# EAGLE design MOL-v1.7 (EAGLE 8.2.2)
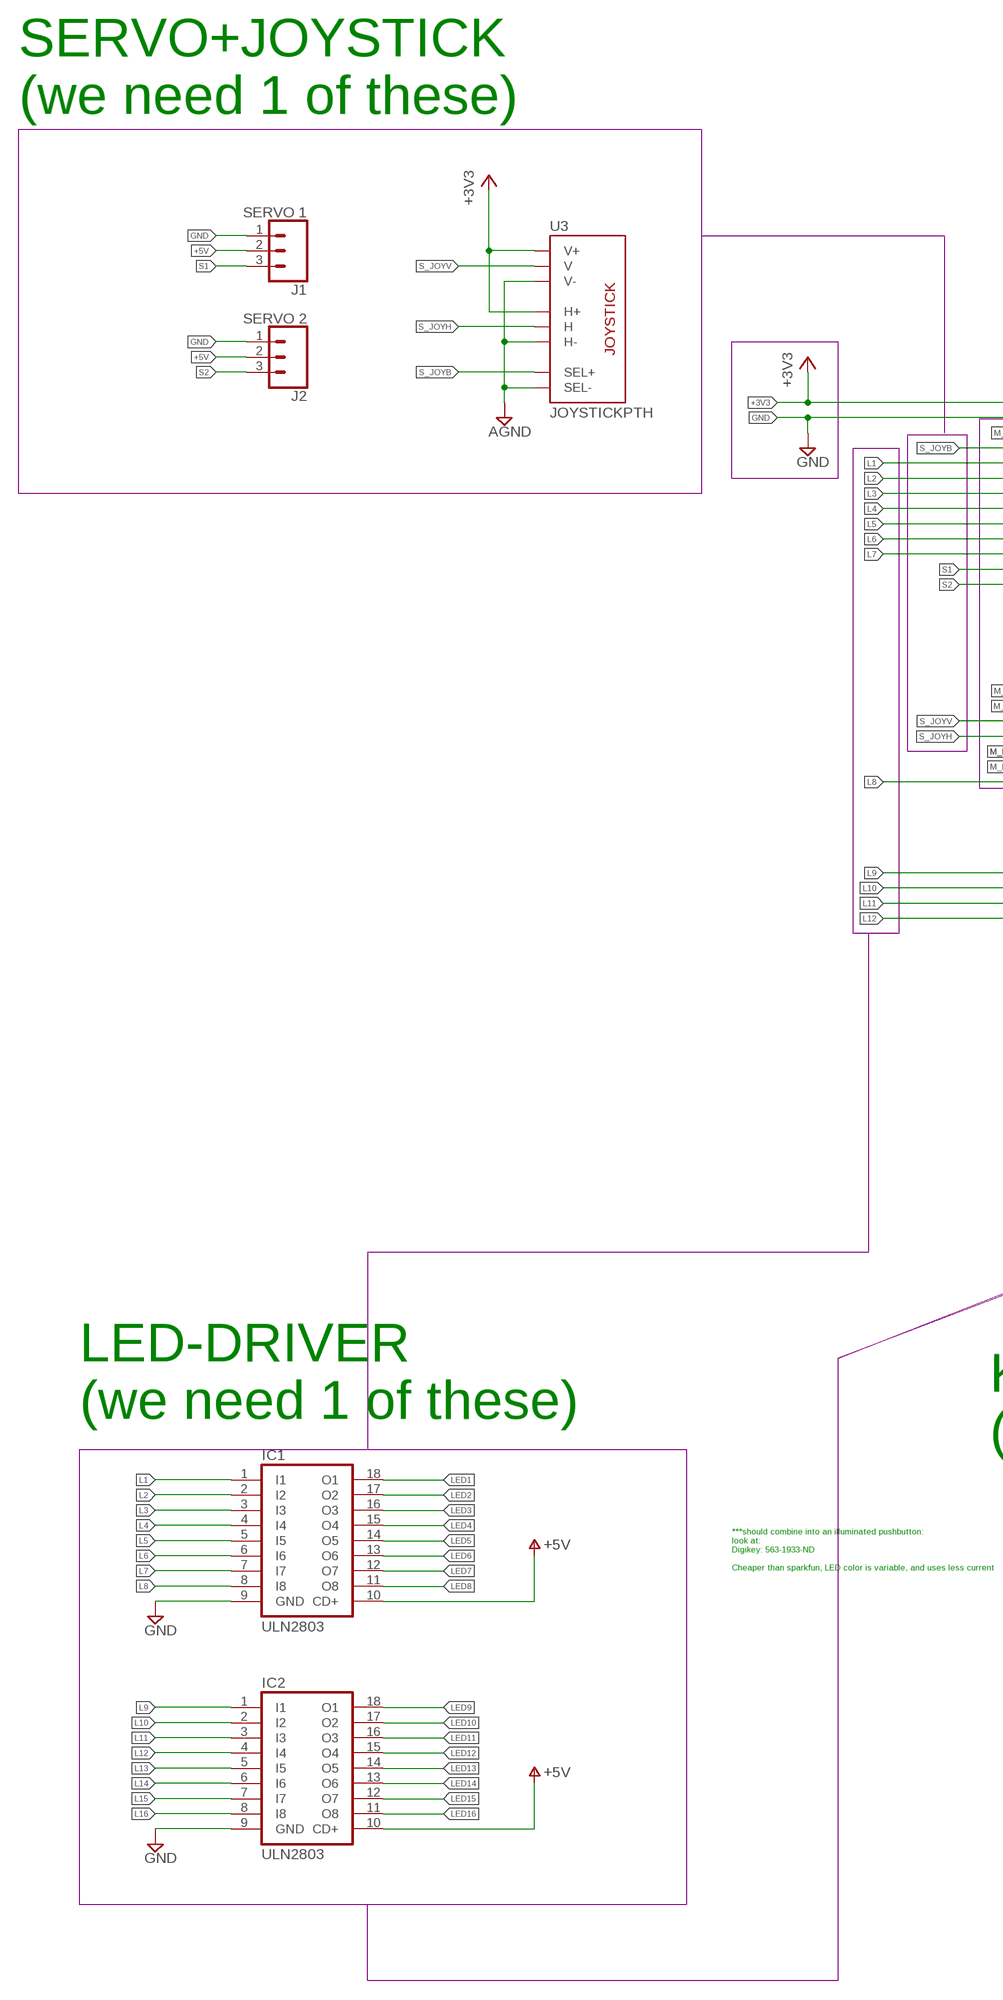
[diagram p0: schematic, sheet 1, part 1 of 2]
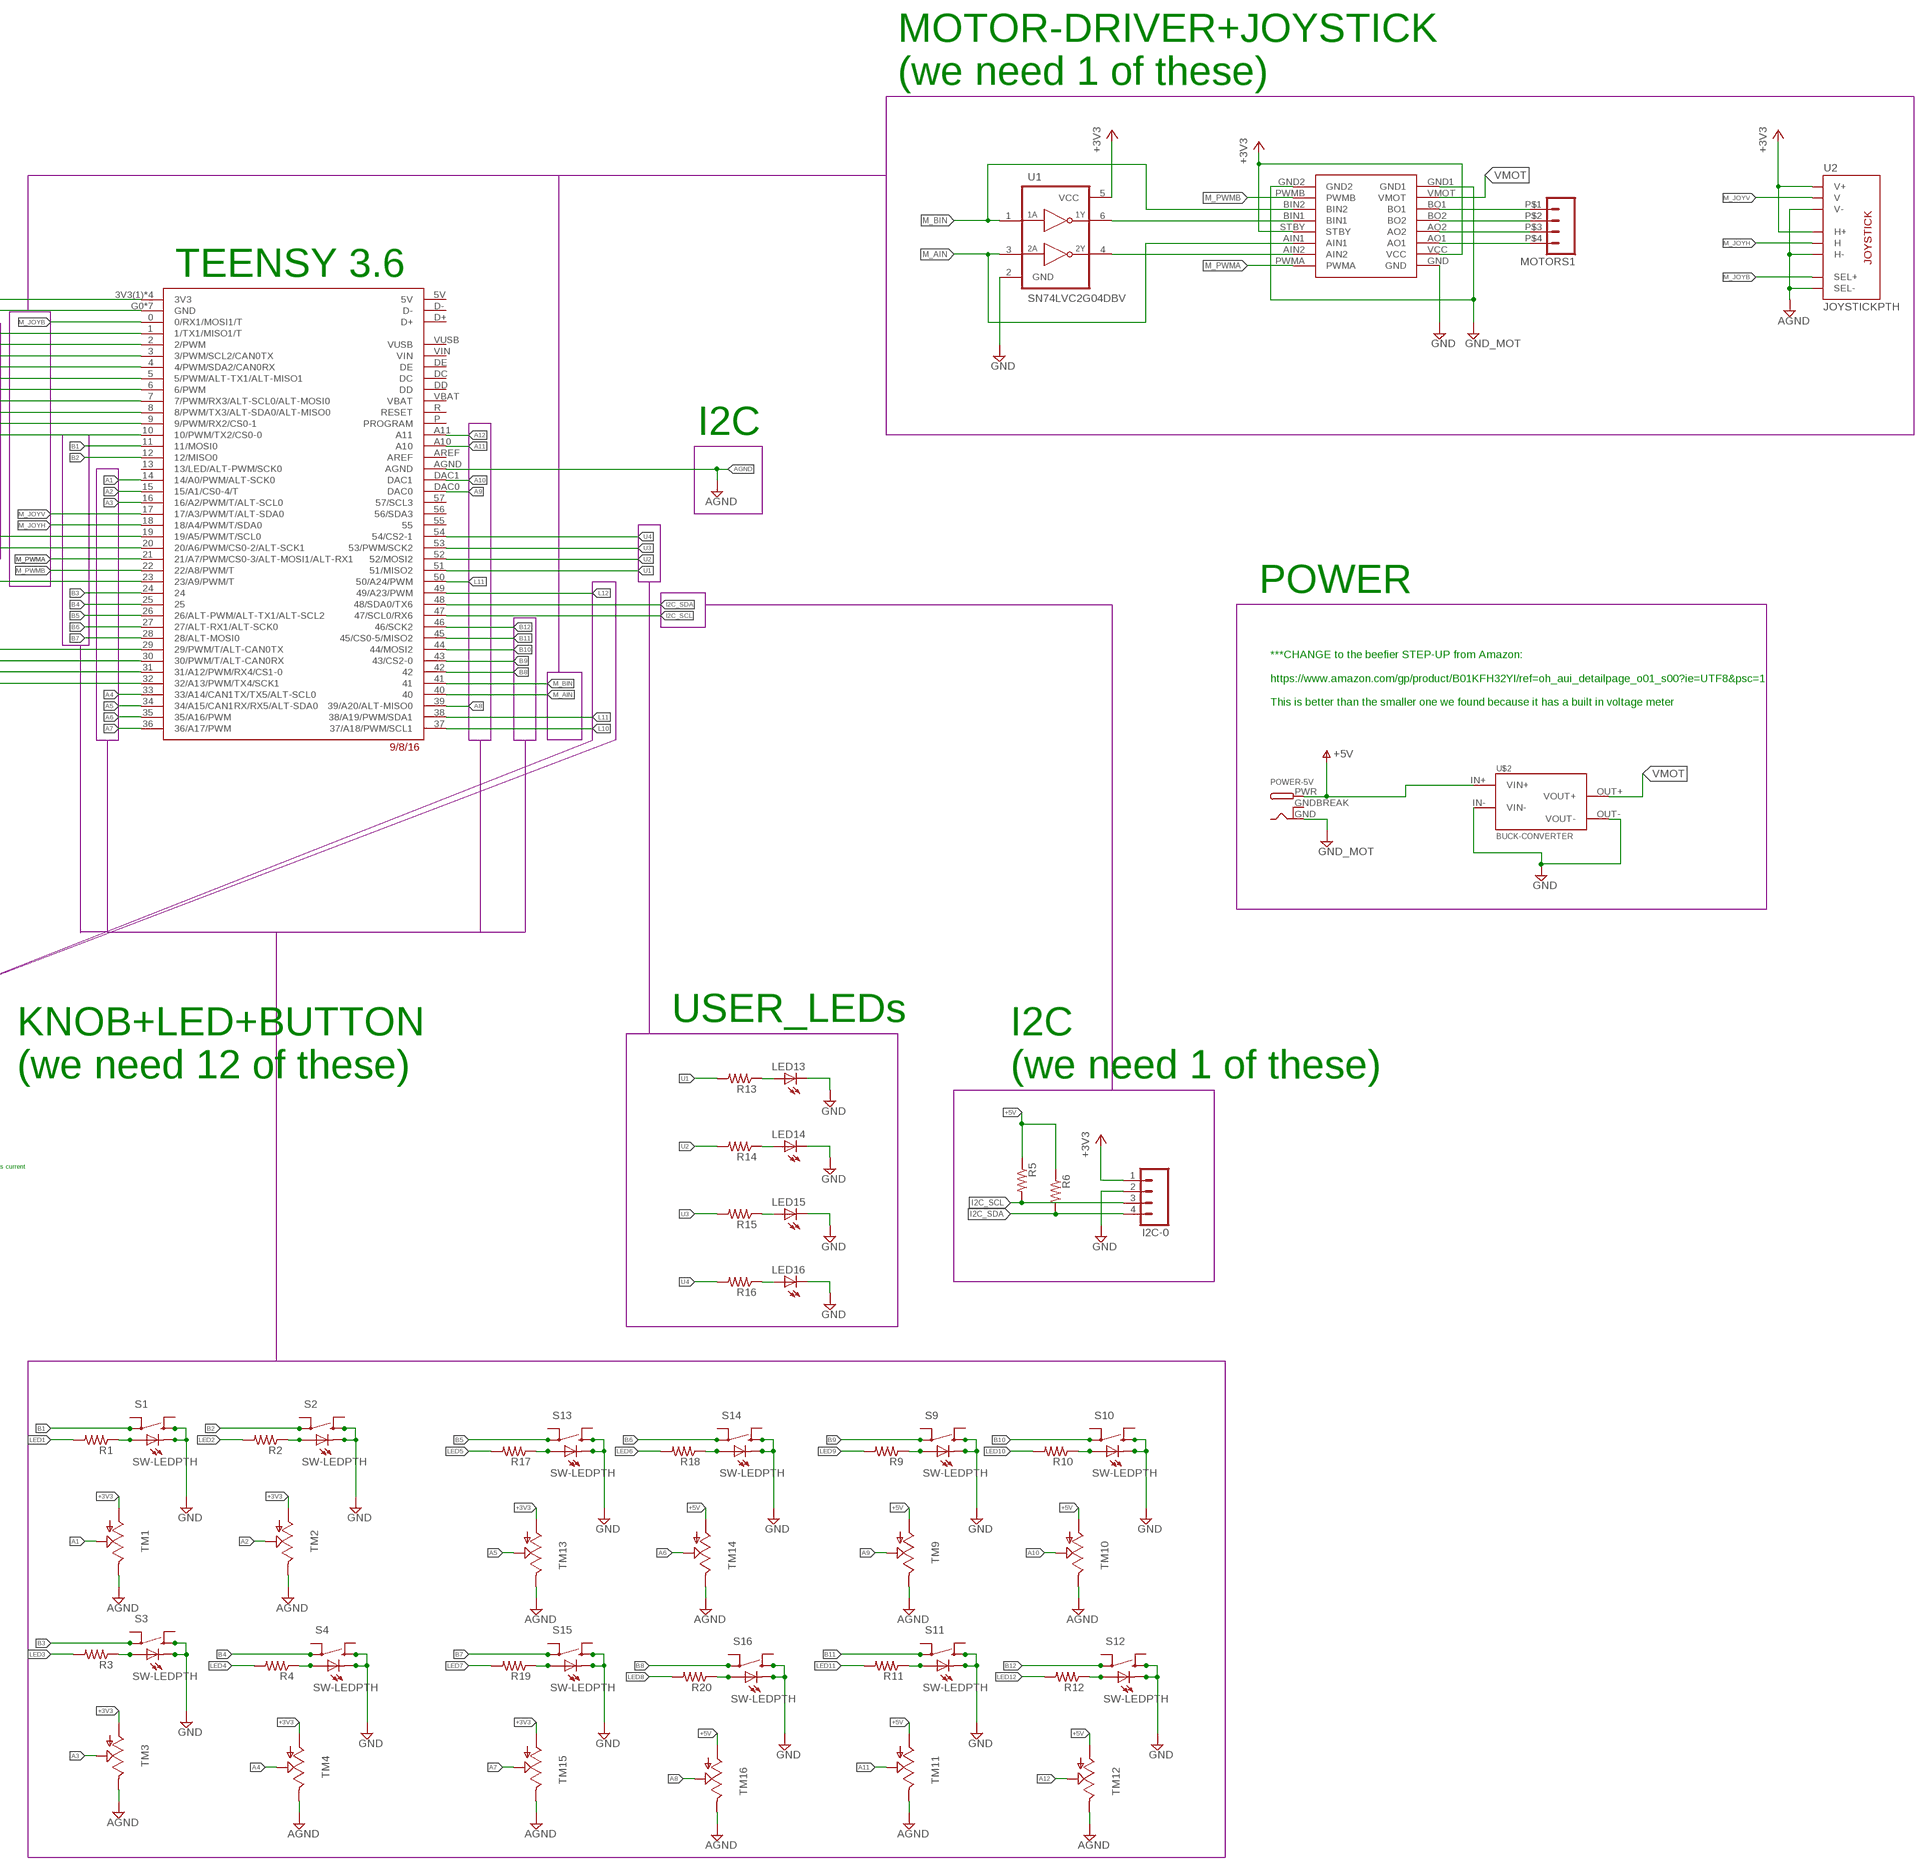
[diagram p1: schematic, sheet 1, part 2 of 2]

## Parts
I2C-0  M04LOCK  [1X04_LOCK]
IC1  ULN2803  ULN2803A  [DIL18]
IC2  ULN2803  ULN2803A  [DIL18]
J1  SERVO 1  CONN_03LOCK  [1X03_LOCK]
J2  SERVO 2  CONN_03LOCK  [1X03_LOCK]
LED13  LED3MM  [LED3MM]
LED14  LED3MM  [LED3MM]
LED15  LED3MM  [LED3MM]
LED16  LED3MM  [LED3MM]
MOTORS1  M04  [SPRINGTERMINAL-2.54MM-4]
POWER-5V  DCBARRELPTH  [DCJACK_2MM_PTH]
R1  R-US_R0603  [R0603]
R2  R-US_R0603  [R0603]
R3  R-US_R0603  [R0603]
R4  R-US_R0603  [R0603]
R5  R-US_R0603  [R0603]
R6  R-US_R0603  [R0603]
R9  R-US_R0603  [R0603]
R10  R-US_R0603  [R0603]
R11  R-US_R0603  [R0603]
R12  R-US_R0603  [R0603]
R13  R-US_R0603  [R0603]
R14  R-US_R0603  [R0603]
R15  R-US_R0603  [R0603]
R16  R-US_R0603  [R0603]
R17  R-US_R0603  [R0603]
R18  R-US_R0603  [R0603]
R19  R-US_R0603  [R0603]
R20  R-US_R0603  [R0603]
S1  SW-LEDPTH  [TR2-SWITCH-MOMENTARY-LED]
S2  SW-LEDPTH  [TR2-SWITCH-MOMENTARY-LED]
S3  SW-LEDPTH  [TR2-SWITCH-MOMENTARY-LED]
S4  SW-LEDPTH  [TR2-SWITCH-MOMENTARY-LED]
S9  SW-LEDPTH  [TR2-SWITCH-MOMENTARY-LED]
S10  SW-LEDPTH  [TR2-SWITCH-MOMENTARY-LED]
S11  SW-LEDPTH  [TR2-SWITCH-MOMENTARY-LED]
S12  SW-LEDPTH  [TR2-SWITCH-MOMENTARY-LED]
S13  SW-LEDPTH  [TR2-SWITCH-MOMENTARY-LED]
S14  SW-LEDPTH  [TR2-SWITCH-MOMENTARY-LED]
S15  SW-LEDPTH  [TR2-SWITCH-MOMENTARY-LED]
S16  SW-LEDPTH  [TR2-SWITCH-MOMENTARY-LED]
TM1  TRIM  [TRIM-PCB-9MM]
TM2  TRIM  [TRIM-PCB-9MM]
TM3  TRIM  [TRIM-PCB-9MM]
TM4  TRIM  [TRIM-PCB-9MM]
TM9  TRIM  [TRIM-PCB-9MM]
TM10  TRIM  [TRIM-PCB-9MM]
TM11  TRIM  [TRIM-PCB-9MM]
TM12  TRIM  [TRIM-PCB-9MM]
TM13  TRIM  [TRIM-PCB-9MM]
TM14  TRIM  [TRIM-PCB-9MM]
TM15  TRIM  [TRIM-PCB-9MM]
TM16  TRIM  [TRIM-PCB-9MM]
U1  SN74LVC2G04DBV  [SOT23-6]
U2  JOYSTICKPTH  [JOYSTICK]
U3  JOYSTICKPTH  [JOYSTICK]
U$1  TEENSY3_6--ALLPINS  [T36]
U$2  BUCK-CONVERTER  [BUCK-CONVERTER]
U$7  POLOLU_TB6612FNG  [POLOLU_TB6612FNG]

## Nets
+3V3: I2C-0.1 TM1.1(A) TM2.1(A) TM3.1(A) TM4.1(A) TM13.1(A) TM15.1(A) U1.5(VCC) U2.H1(H+) U2.V1(V+) U3.H1(H+) U3.V1(V+) U$1.3V3(1)(3V3) U$1.3V3(2)(3V3) U$1.3V3(3)(3V3) U$1.3V3(4)(3V3) U$7.STBY U$7.VCC
+5V [Power]: IC1.10(CD+) IC2.10(CD+) J1.2 J2.2 POWER-5V.PWR R5.1 R6.1 TM9.1(A) TM10.1(A) TM11.1(A) TM12.1(A) TM14.1(A) TM16.1(A) U$2.IN+(VIN+) ; supply symbol labelled V+
A1: TM1.2(S) U$1.14(14/A0/PWM/ALT-SCK0)
A2: TM2.2(S) U$1.15(15/A1/CS0-4/T)
A3: TM3.2(S) U$1.16(16/A2/PWM/T/ALT-SCL0)
A4: TM4.2(S) U$1.33(33/A14/CAN1TX/TX5/ALT-SCL0)
A5: TM13.2(S) U$1.34(34/A15/CAN1RX/RX5/ALT-SDA0)
A6: TM14.2(S) U$1.35(35/A16/PWM)
A7: TM15.2(S) U$1.36(36/A17/PWM)
A8: TM16.2(S) U$1.39(39/A20/ALT-MISO0)
A9: TM9.2(S) U$1.DAC0
A10: TM10.2(S) U$1.DAC1
A11: TM11.2(S) U$1.A10
A12: TM12.2(S) U$1.A11
AGND: TM1.3(E) TM2.3(E) TM3.3(E) TM4.3(E) TM9.3(E) TM10.3(E) TM11.3(E) TM12.3(E) TM13.3(E) TM14.3(E) TM15.3(E) TM16.3(E) U2.B2A(SEL-) U2.H3(H-) U2.V3(V-) U3.B2A(SEL-) U3.H3(H-) U3.V3(V-) U$1.AGND
B1: S1.3 U$1.11(11/MOSI0)
B2: S2.3 U$1.12(12/MISO0)
B3: S3.3 U$1.24
B4: S4.3 U$1.25
B5: S13.3 U$1.26(26/ALT-PWM/ALT-TX1/ALT-SCL2)
B6: S14.3 U$1.27(27/ALT-RX1/ALT-SCK0)
B7: S15.3 U$1.28(28/ALT-MOSI0)
B8: S16.3 U$1.42
B9: S9.3 U$1.43(43/CS2-0)
B10: S10.3 U$1.44(44/MOSI2)
B11: S11.3 U$1.45(45/CS0-5/MISO2)
B12: S12.3 U$1.46(46/SCK2)
GND: I2C-0.2 IC1.9(GND) IC2.9(GND) J1.1 J2.1 LED13.K(C) LED14.K(C) LED15.K(C) LED16.K(C) S1.1 S1.C S2.1 S2.C S3.1 S3.C S4.1 S4.C S9.1 S9.C S10.1 S10.C S11.1 S11.C S12.1 S12.C S13.1 S13.C S14.1 S14.C S15.1 S15.C S16.1 S16.C U1.2(GND) U$1.G0(GND) U$1.G1(GND) U$1.G2(GND) U$1.G3(GND) U$1.G4(GND) U$1.G5(GND) U$1.G6(GND) U$2.IN-(VIN-) U$2.OUT-(VOUT-) U$7.GND
GND_MOT [Power]: POWER-5V.GND U$7.GND1 U$7.GND2
I2C_SCL: I2C-0.3 R5.2 U$1.47(47/SCL0/RX6)
I2C_SDA: I2C-0.4 R6.2 U$1.48(48/SDA0/TX6)
L1: IC1.1(I1) U$1.2(2/PWM)
L2: IC1.2(I2) U$1.3(3/PWM/SCL2/CAN0TX)
L3: IC1.3(I3) U$1.4(4/PWM/SDA2/CAN0RX)
L4: IC1.4(I4) U$1.5(5/PWM/ALT-TX1/ALT-MISO1)
L5: IC1.5(I5) U$1.6(6/PWM)
L6: IC1.6(I6) U$1.7(7/PWM/RX3/ALT-SCL0/ALT-MOSI0)
L7: IC1.7(I7) U$1.8(8/PWM/TX3/ALT-SDA0/ALT-MISO0)
L8: IC1.8(I8) U$1.23(23/A9/PWM/T)
L9: IC2.1(I1) U$1.29(29/PWM/T/ALT-CAN0TX)
L10: IC2.2(I2) U$1.30(30/PWM/T/ALT-CAN0RX) U$1.37(37/A18/PWM/SCL1)
L11: IC2.3(I3) U$1.31(31/A12/PWM/RX4/CS1-0) U$1.38(38/A19/PWM/SDA1) U$1.50(50/A24/PWM)
L12: IC2.4(I4) U$1.32(32/A13/PWM/TX4/SCK1) U$1.49(49/A23/PWM)
L13: IC2.5(I5)
L14: IC2.6(I6)
L15: IC2.7(I7)
L16: IC2.8(I8)
LED1: IC1.18(O1) R1.2
LED2: IC1.17(O2) R2.2
LED3: IC1.16(O3) R3.2
LED4: IC1.15(O4) R4.2
LED5: IC1.14(O5) R17.2
LED6: IC1.13(O6) R18.2
LED7: IC1.12(O7) R19.2
LED8: IC1.11(O8) R20.2
LED9: IC2.18(O1) R9.2
LED10: IC2.17(O2) R10.2
LED11: IC2.16(O3) R11.2
LED12: IC2.15(O4) R12.2
LED13: IC2.14(O5)
LED14: IC2.13(O6)
LED15: IC2.12(O7)
LED16: IC2.11(O8)
M_AIN: U1.3(2A) U$1.40 U$7.AIN1
M_BIN: U1.1(1A) U$1.41 U$7.BIN2
M_JOYB: U2.B1A(SEL+) U$1.0(0/RX1/MOSI1/T)
M_JOYH: U2.H2(H) U$1.18(18/A4/PWM/T/SDA0)
M_JOYV: U2.V2(V) U$1.17(17/A3/PWM/T/ALT-SDA0)
M_PWMA: U$1.21(21/A7/PWM/CS0-3/ALT-MOSI1/ALT-RX1) U$7.PWMA
M_PWMB: U$1.22(22/A8/PWM/T) U$7.PWMB
N$1: R1.1 S1.A
N$2: LED13.A R13.1
N$3: LED14.A R14.1
N$4: LED15.A R15.1
N$5: U1.6(1Y) U$7.BIN1
N$6: U1.4(2Y) U$7.AIN2
N$7: LED16.A R16.1
N$8: R2.1 S2.A
N$9: R3.1 S3.A
N$10: R4.1 S4.A
N$15: R9.1 S9.A
N$16: R10.1 S10.A
N$17: R11.1 S11.A
N$18: R12.1 S12.A
N$19: R17.1 S13.A
N$20: R18.1 S14.A
N$21: R19.1 S15.A
N$22: R20.1 S16.A
N$45 [Power]: MOTORS1.P$1 U$7.BO1
N$46 [Power]: MOTORS1.P$2 U$7.BO2
N$52 [Power]: MOTORS1.P$3 U$7.AO2
N$54 [Power]: MOTORS1.P$4 U$7.AO1
S1: J1.3 U$1.9(9/PWM/RX2/CS0-1)
S2: J2.3 U$1.10(10/PWM/TX2/CS0-0)
S_JOYB: U3.B1A(SEL+) U$1.1(1/TX1/MISO1/T)
S_JOYH: U3.H2(H) U$1.20(20/A6/PWM/CS0-2/ALT-SCK1)
S_JOYV: U3.V2(V) U$1.19(19/A5/PWM/T/SCL0)
U1: R13.2 U$1.51(51/MISO2)
U2: R14.2 U$1.52(52/MOSI2)
U3: R15.2 U$1.53(53/PWM/SCK2)
U4: R16.2 U$1.54(54/CS2-1)
VMOT [Power]: U$2.OUT+(VOUT+) U$7.VMOT
Unconnected: S1.2 S1.4 S2.2 S2.4 S3.2 S3.4 S4.2 S4.4 S9.2 S9.4 S10.2 S10.4 S11.2 S11.4 S12.2 S12.4 S13.2 S13.4 S14.2 S14.4 S15.2 S15.4 S16.2 S16.4 U$1.5V U$1.13(13/LED/ALT-PWM/SCK0) U$1.55 U$1.56(56/SDA3) U$1.57(57/SCL3) U$1.AREF U$1.D+ U$1.D- U$1.DC U$1.DD U$1.DE U$1.P(PROGRAM) U$1.R(RESET) U$1.VBAT U$1.VIN U$1.VUSB

## Notes on the sheet
- SERVO+JOYSTICK
  (we need 1 of these)
- MOTOR-DRIVER+JOYSTICK
  (we need 1 of these)
- TEENSY 3.6
- I2C
- POWER
- ***CHANGE to the beefier STEP-UP from Amazon:
  
  https://www.amazon.com/gp/product/B01KFH32YI/ref=oh_aui_detailpage_o01_s00?ie=UTF8&psc=1
  
  This is better than the smaller one we found because it has a built in voltage meter
- USER_LEDs
- LED-DRIVER
  (we need 1 of these)
- KNOB+LED+BUTTON
  (we need 12 of these)
- I2C
  (we need 1 of these)
- ***should combine into an illuminated pushbutton:
  look at:
  Digikey: 563-1933-ND
  
  Cheaper than sparkfun, LED color is variable, and uses less current

## Power pins joined to a net without a drawn wire
GNDBREAK: POWER-5V.GNDBREAK

## Library data of the parts
I2C-0 MOTORS1 = CMU-ArtFab:M04: Header 4 Standard 4-pin 0.1" header. Use with straight break away headers (SKU : PRT-00116), right angle break away headers (PRT-00553), swiss pins (PRT-00743), machine pins (PRT-00117), and female headers (PRT-00115). Molex polarized connector foot print use with SKU : PRT-08231 with associated crimp pins and housings. 1MM SMD Version SKU: PRT-10208
IC1 IC2 = uln-udn:ULN2803A: DRIVER ARRAY
J1 J2 = SparkFun-Connectors:CONN_03: Multi connection point. Often used as Generic Header-pin footprint for 0.1 inch spaced/style header connections On any of the 0.1 inch spaced packages, you can populate with these: Break Away Headers - Straight <https://www.sparkfun.com/products/116> (PRT-00116) Break Away Male Headers - Right Angle <https://www.sparkfun.com/products/553> (PRT-00553) Female Headers <https://www.sparkfun.com/products/115> (PRT-00115) Break Away Headers - Machine Pin <https://www.sparkfun.com/products/117> (PRT-00117) Break Away Female Headers - Swiss Machine Pin <https://www.sparkfun.com/products/743> (PRT-00743) Stackable Header - 3 Pin (Female, 0.1") <https://www.sparkfun.com/products/13875> (PRT-13875) For SCREWTERMINALS and SPRING TERMINALS visit here: Screw Terimnals on SparkFun.com <https://www.sparkfun.com/search/results?term=Screw+Terminals> (5mm/3.5mm/2.54mm spacing) This device is also useful as a general connection point to wire up your design to another part of your project. Our various solder wires solder well into these plated through hole pads. Hook-Up Wire - Assortment (Stranded, 22 AWG) <https://www.sparkfun.com/products/11375> (PRT-11375) Hook-Up Wire - Assortment (Solid Core, 22 AWG) <https://www.sparkfun.com/products/11367> (PRT-11367) View the entire wire category on our website here <https://www.sparkfun.com/categories/141> Special notes: Molex polarized connector foot print use with SKU : PRT-08232 with associated crimp pins and housings.
LED13-LED16 = led:LED: LED OSRAM: - CHIPLED LG R971, LG N971, LY N971, LG Q971, LY Q971, LO R971, LY R971 LH N974, LH R974 LS Q976, LO Q976, LY Q976 LO Q996 - Hyper CHIPLED LW Q18S LB Q993, LB Q99A, LB R99A - SideLED LS A670, LO A670, LY A670, LG A670, LP A670 LB A673, LV A673, LT A673, LW A673 LH A674 LY A675 LS A676, LA A676, LO A676, LY A676, LW A676 LS A679, LY A679, LG A679 - Hyper Micro SIDELED® LS Y876, LA Y876, LO Y876, LY Y876 LT Y87S - SmartLED LW L88C, LW L88S LB L89C, LB L89S, LG L890 LS L89K, LO L89K, LY L89K LS L896, LA L896, LO L896, LY L896 - TOPLED LS T670, LO T670, LY T670, LG T670, LP T670 LSG T670, LSP T670, LSY T670, LOP T670, LYG T670 LG T671, LOG T671, LSG T671 LB T673, LV T673, LT T673, LW T673 LH T674 LS T676, LA T676, LO T676, LY T676, LB T676, LH T676, LSB T676, LW T676 LB T67C, LV T67C, LT T67C, LS T67K, LO T67K, LY T67K, LW E67C LS E67B, LA E67B, LO E67B, LY E67B, LB E67C, LV E67C, LT E67C LW T67C LS T679, LY T679, LG T679 LS T770, LO T770, LY T770, LG T770, LP T770 LB T773, LV T773, LT T773, LW T773 LH T774 LS E675, LA E675, LY E675, LS T675 LS T776, LA T776, LO T776, LY T776, LB T776 LHGB T686 LT T68C, LB T68C - Hyper Mini TOPLED® LB M676 - Mini TOPLED Santana® LG M470 LS M47K, LO M47K, LY M47K Source: http://www.osram.convergy.de LUXEON: - LUMILED® LXK2-PW12-R00, LXK2-PW12-S00, LXK2-PW14-U00, LXK2-PW14-V00 LXK2-PM12-R00, LXK2-PM12-S00, LXK2-PM14-U00 LXK2-PE12-Q00, LXK2-PE12-R00, LXK2-PE12-S00, LXK2-PE14-T00, LXK2-PE14-U00 LXK2-PB12-K00, LXK2-PB12-L00, LXK2-PB12-M00, LXK2-PB14-N00, LXK2-PB14-P00, LXK2-PB14-Q00 LXK2-PR12-L00, LXK2-PR12-M00, LXK2-PR14-Q00, LXK2-PR14-R00 LXK2-PD12-Q00, LXK2-PD12-R00, LXK2-PD12-S00 LXK2-PH12-R00, LXK2-PH12-S00 LXK2-PL12-P00, LXK2-PL12-Q00, LXK2-PL12-R00 Source: www.luxeon.com KINGBRIGHT: KA-3528ASYC Source: www.kingbright.com
POWER-5V = adafruit:DCBARREL: 2.0mm DC Barrel Jack DCJACK_2MM_PTH - Through Hole Jack (4UConnector: 05537)
R1-R6 R9-R20 = CMU-ArtFab:R-US_: RESISTOR, American symbol
S1-S4 S9-S16 = Daniel:SW-LED: SWITCH PUSH SPST-NO 10MA 12V
TM1-TM4 TM9-TM16 = Daniel:TRIM
U1 = 74LV:SN74LVC2G04: DUAL INVERTER GATE
U2 U3 = adafruit:JOYSTICK: Thumb Joystick Joystick commonly found in PS2 controllers. Two pots and a select switch. Adapted from Sparkfun Library (but for more common 6mm switch sticks)
U$1 = Teensy_3_6:TEENSY3_6--ALLPINS
U$2 = Daniel:BUCK-CONVERTER
U$7 = CMU-ArtFab:POLOLU_TB6612FNG

## Net classes
2 Power: width 0.508 mm, clearance 0.152 mm

## Board
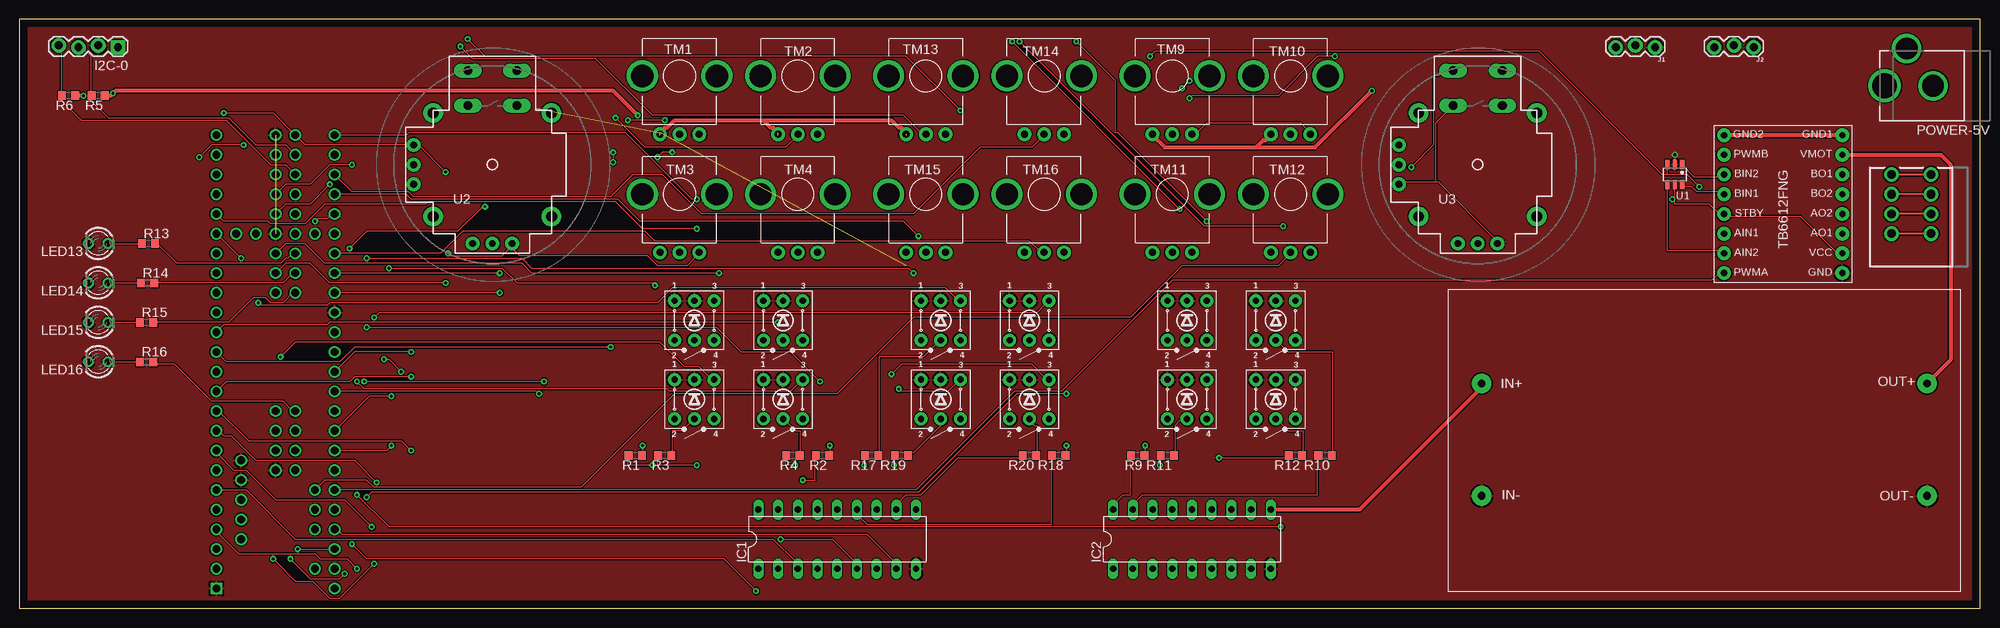
[diagram p2: board, top side]
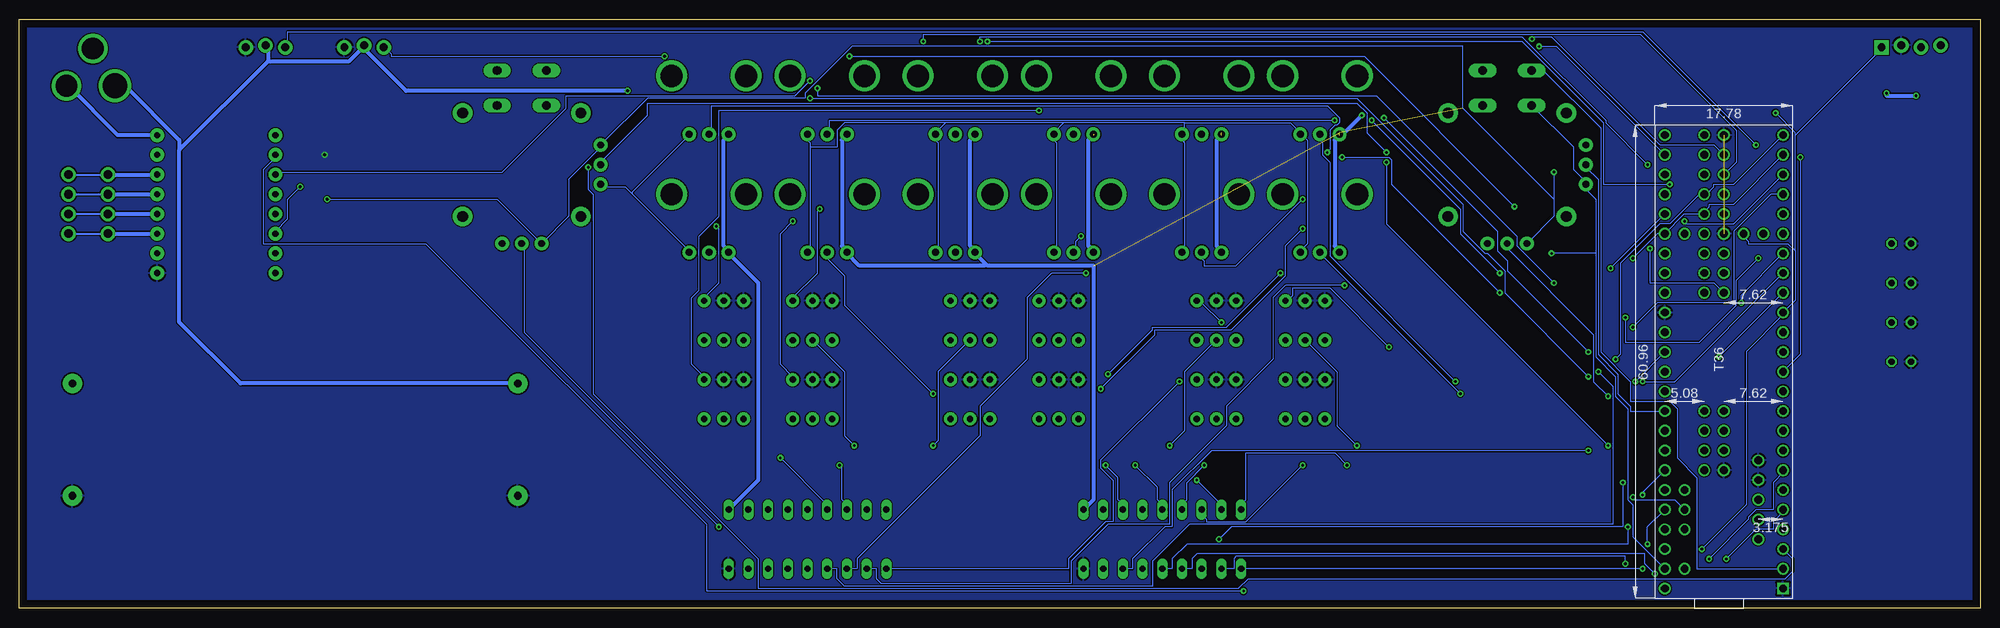
[diagram p3: board, bottom side, seen from below]

Size 252.71 x 75.87 mm. Coordinates in mm from the lower left corner, seen from the top.
Outline: 0,0 252.71,0 252.71,75.87 0,75.87 0,0
Copper layers (1*16): Top 0.035mm / dielectric 1.5mm / Bottom 0.035mm
Design rules "default": minimum track width 6mil, minimum drill 0.35mm, track to track 6mil, track to pad 6mil, pad to pad 6mil, via to via 6mil, smd to smd 6mil, copper to edge 40mil, drill to drill 6mil, minimum pad ring 10mil, minimum via ring 8mil, stop-mask expansion 4mil, vias tented up to drill 0mil, thermal gap 10mil

### Footprints (pad centres in the part's own frame; a part is rotated, then mirrored left to right if it is on the bottom)
1X04_LOCK = drill 1.016 pad 1.88 square: 1 0,0.127 | drill 1.016 pad 1.88: 2 2.54,-0.127; 3 5.08,0.127; 4 7.62,-0.127
DIL18 = drill 0.813 long: 1 -10.16,-3.81; 2 -7.62,-3.81; 3 -5.08,-3.81; 4 -2.54,-3.81; 5 0,-3.81; 6 2.54,-3.81; 7 5.08,-3.81; 8 7.62,-3.81; 9 10.16,-3.81; 10 10.16,3.81; 11 7.62,3.81; 12 5.08,3.81; 13 2.54,3.81; 14 0,3.81; 15 -2.54,3.81; 16 -5.08,3.81; 17 -7.62,3.81; 18 -10.16,3.81
1X03_LOCK = drill 1.016 pad 1.88: 1 0,0.127; 2 2.54,-0.127; 3 5.08,0.127
LED3MM = drill 0.813 octagon: A -1.27,0; K 1.27,0
SPRINGTERMINAL-2.54MM-4 = drill 1.1 pad 1.9: 1 7.62,-2.54; 2 5.08,-2.54; 3 2.54,-2.54; 4 0,-2.54; P$1 7.62,2.54; P$2 5.08,2.54; P$3 2.54,2.54; P$4 0,2.54
DCJACK_2MM_PTH = drill 2.8: GND 0,7.35; GNDBREAK 4.8,10.75 | drill 3.2: PWR 0,13.6
R0603 = smd 1 x 1.1: 1 -0.85,0; 2 0.85,0
TR2-SWITCH-MOMENTARY-LED = drill 0.8 pad 1.676: 1 2.54,-2.54; 2 2.54,2.54; 3 -2.54,-2.54; 4 -2.54,2.54; A 0,2.54; C 0,-2.54
TRIM-PCB-9MM = drill 0.9 pad 1.778: 1 -2.54,-7.5; 2 0,-7.5; 3 2.54,-7.5 | drill 2.845 pad 4: 5 -4.8,0; 6 -4.8,0; M1 -4.8,0; M2 4.8,0
SOT23-6 = smd 0.55 x 1.2: 1 -0.95,-1.3; 2 0,-1.3; 3 0.95,-1.3; 4 0.95,1.3; 5 0,1.3; 6 -0.95,1.3
JOYSTICK = drill 1.1 pad 1.778 long: B1A -3.175,12.12; B1B 3.175,12.12; B2A -3.175,7.62; B2B 3.175,7.62 | drill 0.889 pad 1.778: H1 -2.54,-10.16; H2 0,-10.16; H3 2.54,-10.16; V1 -10.16,2.54; V2 -10.16,0; V3 -10.16,-2.54 | drill 1.397 pad 2.54: MOUNT1 -7.62,6.668; MOUNT2 -7.62,-6.668; MOUNT3 7.62,-6.668; MOUNT4 7.62,6.668
T36 = drill 1: 0 -15.24,-5.08; 1 -12.7,-5.08; 2 -10.16,-5.08; 3 -7.62,-5.08; 3V3(1) 17.78,-5.08; 3V3(2) 27.94,0; 3V3(3) -12.7,10.16; 3V3(4) 40.64,5.08; 4 -5.08,-5.08; 5 -2.54,-5.08; 5V -11.43,-1.905; 6 0,-5.08; 7 2.54,-5.08; 8 5.08,-5.08; 9 7.62,-5.08; 10 10.16,-5.08; 11 12.7,-5.08; 12 15.24,-5.08; 13 15.24,10.16; 14 12.7,10.16; 15 10.16,10.16; 16 7.62,10.16; 17 5.08,10.16; 18 2.54,10.16; 19 0,10.16; 20 -2.54,10.16; 21 -5.08,10.16; 22 -7.62,10.16; 23 -10.16,10.16; 24 20.32,-5.08; 25 22.86,-5.08; 26 25.4,-5.08; 27 27.94,-5.08; 28 30.48,-5.08; 29 33.02,-5.08; 30 35.56,-5.08; 31 38.1,-5.08; 32 40.64,-5.08; 33 40.64,10.16; 34 38.1,10.16; 35 35.56,10.16; 36 33.02,10.16; 37 30.48,10.16; 38 27.94,10.16; 39 25.4,10.16; 40 20.32,2.54; 41 22.86,2.54; 42 25.4,2.54; 43 30.48,2.54; 44 33.02,2.54; 45 35.56,2.54; 46 38.1,2.54; 47 38.1,5.08; 48 35.56,5.08; 49 33.02,5.08; 50 30.48,5.08; 51 25.4,5.08; 52 22.86,5.08; 53 20.32,5.08; 54 5.08,5.08; 55 2.54,5.08; 56 0,5.08; 57 -2.54,5.08; A10 -7.62,7.62; A11 -5.08,7.62; AGND -15.24,10.16; AREF -10.16,7.62; D+ -6.35,-1.905; D- -8.89,-1.905; DAC0 22.86,10.16; DAC1 20.32,10.16; DC 2.54,2.54; DD 5.08,2.54; DE 0,2.54; G1 27.94,2.54; G2 17.78,10.16; G3 40.64,2.54; G4 -3.81,-1.905; G5 -1.27,-1.905; G6 -2.54,2.54; P 27.94,5.08; R 27.94,7.62; VBAT 27.94,-2.54; VIN -17.78,10.16; VUSB -15.24,7.62 | drill 1 square: G0 -17.78,-5.08
BUCK-CONVERTER = drill 1 pad 2.54: IN+ -28.702,7.366; IN- -28.702,-7.112; OUT+ 28.702,7.366; OUT- 28.702,-7.112 | drill 0.6 square: P$1 28.702,-7.112; P$2 28.702,7.366; P$6 -28.702,7.366
POLOLU_TB6612FNG = drill 0.8 pad 1.778: AIN1 7.62,3.81; AIN2 7.62,6.35; AO1 -7.62,3.81; AO2 -7.62,1.27; BIN1 7.62,-1.27; BIN2 7.62,-3.81; BO1 -7.62,-3.81; BO2 -7.62,-1.27; GND -7.62,8.89; GND1 -7.62,-8.89; GND2 7.62,-8.89; PWMA 7.62,8.89; PWMB 7.62,-6.35; STBY 7.62,1.27; VCC -7.62,6.35; VMOT -7.62,-6.35

### Placement (x,y rotation side)
I2C-0  12.7,72.39 180 top
IC1  105.41,8.89 0 top
IC2  151.13,8.89 0 top
J1  210.82,72.39 180 top
J2  223.52,72.39 180 top
LED13  10.16,46.99 180 top
LED14  10.16,41.91 180 top
LED15  10.16,36.83 180 top
LED16  10.16,31.75 180 top
MOTORS1  243.84,48.26 90 top
POWER-5V  254,67.31 90 top
R1  79.38,19.68 180 top
R2  103.5,19.68 180 top
R3  83.19,19.68 180 top
R4  99.69,19.68 180 top
R5  10.16,66.04 180 top
R6  6.35,66.04 180 top
R9  144.15,19.68 180 top
R10  168.28,19.68 180 top
R11  147.96,19.68 180 top
R12  164.47,19.68 180 top
R13  16.64,46.99 0 top
R14  16.51,41.91 0 top
R15  16.38,36.83 0 top
R16  16.38,31.75 0 top
R17  109.86,19.68 180 top
R18  133.99,19.68 180 top
R19  113.67,19.68 180 top
R20  130.18,19.68 180 top
S1  87,37.08 180 top
S2  98.42,37.08 180 top
S3  87,26.92 180 top
S4  98.42,26.92 180 top
S9  150.5,37.08 180 top
S10  161.93,37.08 180 top
S11  150.5,26.92 180 top
S12  161.93,26.92 180 top
S13  118.75,37.08 180 top
S14  130.18,37.08 180 top
S15  118.75,26.92 180 top
S16  130.18,26.92 180 top
TM1  85.09,68.58 0 top
TM2  100.33,68.58 0 top
TM3  85.09,53.34 0 top
TM4  100.33,53.34 0 top
TM9  148.59,68.58 0 top
TM10  163.83,68.58 0 top
TM11  148.59,53.34 0 top
TM12  163.83,53.34 0 top
TM13  116.84,68.58 0 top
TM14  132.08,68.58 0 top
TM15  116.84,53.34 0 top
TM16  132.08,53.34 0 top
U1  213.36,55.88 180 top
U2  60.96,57.15 0 top
U3  187.96,57.15 0 top
U$1  30.48,20.32 90 bottom
U$2  217.17,21.59 0 top
U$7  227.33,52.07 180 top

### Tracks (layer width: path | path; a pad name or v marks a point on that pad's centre or on a via)
+3V3  (via drill 0.35)  (6 unrouted)
  Top 0.152: 213.36,52.7 213.36,52.07 217.81,52.07 219.07,50.8 U$7.STBY 220.03,50.48 229.55,50.48 234,46.04 234.63,46.04 U$7.VCC | 213.36,52.7 U1.5 | 213.36,52.7 v213.04,52.7 | v54.93,56.2 51.44,59.69 U2.V1 36.83,59.69 U$1.3V3(4) 32.7,63.82 v26.35,63.82 | v35.88,7.62 U$1.3V3(3)
  Top 0.508: 97.79,61.28 97.16,61.91 96.84,61.91 96.04,62.71 | 96.04,62.71 95.89,62.87 84.45,62.87 83.5,61.91 83.19,61.91 82.55,61.28 | TM13.1 114.3,61.28 113.67,61.91 113.35,61.91 112.39,62.87 96.2,62.87 96.04,62.71
  Bottom 0.152: v213.04,52.7 191.13,52.7 U3.H1 181.93,50.48 181.93,55.24 177.8,59.37 U3.V1 171.77,65.72 151.45,65.72 151.45,66.36 145.41,72.39 66.67,72.39 66.67,64.45 54.93,52.7 | U2.H1 54.93,50.48 54.93,52.7 | v54.93,56.2 54.93,52.7 | 23.81,46.04 23.81,39.69 U$1.3V3(1) 25.4,37.78 30.16,33.02 30.16,13.34 v35.88,7.62 | 23.81,46.04 24.77,46.99 29.84,46.99 29.84,47.31 30.48,47.94 U$1.3V3(2) | 23.81,60.96 12.7,72.07 I2C-0.1 | 23.81,46.04 23.81,60.96 | v26.35,63.82 23.81,61.28 23.81,60.96
  Bottom 0.508: 82.55,60.96 83.19,60.33 83.19,46.67 82.55,46.04 TM3.1 | 97.79,60.96 98.42,60.33 98.42,46.67 97.79,46.04 TM4.1 | 114.3,60.96 114.94,60.33 114.94,46.67 114.3,46.04 TM15.1
+5V  (via drill 0.35)  (1 unrouted)
  Top 0.508: 159.54,59.53 159.38,59.37 147.64,59.37 146.05,60.96 TM9.1 | 159.54,59.53 160.34,60.33 160.66,60.33 161.29,60.96 TM10.1 | v8.26,66.04 R6.1 | R5.1 11.75,66.04 v12.06,66.36 12.38,66.67 76.52,66.67 v79.69,63.5 | v174.31,66.67 167,59.37 159.7,59.37 159.54,59.53 | U$2.IN+ 188.47,28.45 172.72,12.7 IC2.10
  Bottom 0.508: 220.66,70.48 210.19,70.48 208.28,72.39 J1.2 208.28,72.07 202.88,66.67 v174.31,66.67 | 220.66,70.48 220.66,72.07 220.98,72.39 J2.2 | 232.09,59.05 232.09,60.33 239.08,67.31 POWER-5V.PWR | 232.09,59.05 232.09,36.83 224.22,28.96 U$2.IN+ | 232.09,59.05 220.66,70.48 | IC2.10 157.48,16.51 157.48,41.91 161.29,45.72 TM12.1 161.29,46.04 161.93,46.67 161.93,60.33 161.29,60.96 TM10.1 | TM9.1 146.05,60.96 146.69,60.33 146.69,46.67 146.05,46.04 TM11.1 146.05,45.72 144.46,44.13 128.27,44.13 128.11,44.29 | IC1.10 114.3,13.97 114.3,44.13 127.95,44.13 128.11,44.29 | 128.11,44.29 129.54,45.72 TM16.1 129.54,46.04 130.18,46.67 130.18,60.33 129.54,60.96 TM14.1 | v8.26,66.04 12.06,66.04 v12.06,66.36 | v79.69,63.5 81.92,61.28 82.55,61.28
A1  (via drill 0.35)
  Top 0.152: v67.63,29.21 v44.45,29.21
  Bottom 0.152: v44.45,29.21 U$1.14 | v67.63,29.21 83.82,45.4 83.82,57.47 84.77,58.42 84.77,60.01 85.09,60.33 TM1.2
A2  (via drill 0.35)
  Top 0.152: U$1.15 43.18,33.02 v50.48,33.02 | v76.83,63.18 80.64,59.37 98.74,59.37 100.33,60.96 TM2.2
  Bottom 0.152: v50.48,33.02 60.96,43.5 60.96,44.77 62.23,46.04 62.23,48.58 v76.83,63.18
A3  (via drill 0.35)
  Top 0.152: U$1.16 66.67,27.94 v66.99,27.62
  Bottom 0.152: v66.99,27.62 85.09,45.72 TM3.2
A4  (via drill 0.35)
  Top 0.152: U$1.33 49.85,60.96 50.16,61.28 78.11,61.28 86.68,52.7 v87.31,52.7
  Bottom 0.152: v87.31,52.7 95.89,44.13 100.01,44.13 100.01,44.77 100.33,45.09 TM4.2
A5  (via drill 0.35)
  Top 0.152: v56.83,72.39 58.42,70.8 74.3,70.8 81.6,63.5 113.98,63.5 116.2,61.28 116.84,61.28 TM13.2
  Bottom 0.152: U$1.34 54.61,72.39 v56.83,72.39
A6
  Top 0.152: U$1.35 42.86,53.66 50.16,53.66 50.8,53.02 76.2,53.02 79.06,55.88 82.87,55.88 87.95,50.8 115.25,50.8 123.83,59.37 130.49,59.37 132.08,60.96 TM14.2
A7  (via drill 0.35)
  Top 0.152: U$1.36 49.85,53.34 50.48,52.7 77.15,52.7 80.01,49.85 113.98,49.85 v115.89,47.94
  Bottom 0.152: v115.89,47.94 116.52,47.31 116.52,46.35 116.84,46.04 TM15.2
A8
  Top 0.152: U$1.39 54.29,45.72 57.15,48.58 80.64,48.58 81.92,47.31 130.18,47.31 131.44,46.04 132.08,46.04 TM16.2
A9  (via drill 0.35)
  Top 0.152: v61.91,43.18 U$1.DAC0 | v83.19,62.87 v78.42,62.87
  Bottom 0.152: v61.91,43.18 66.99,48.26 66.99,51.44 v78.42,62.87 | v83.19,62.87 148.27,62.87 148.27,61.59 148.59,61.28 TM9.2
A10  (via drill 0.35)
  Top 0.152: v61.91,40.64 U$1.DAC1 | v82.23,58.1 82.87,58.74 v84.14,58.74
  Bottom 0.152: v61.91,40.64 75.88,54.61 75.88,57.78 76.2,58.1 v82.23,58.1 | v84.14,58.74 83.82,59.05 83.82,61.59 83.19,62.23 82.87,62.23 82.55,62.55 82.55,63.18 84.14,64.77 163.51,64.77 163.51,61.59 163.83,61.28 TM10.2
A11  (via drill 0.35)
  Top 0.152: v44.77,14.29 45.4,14.92 115.89,14.92 128.59,27.62 v134.94,27.62
  Bottom 0.152: U$1.A10 39.37,13.97 44.77,13.97 v44.77,14.29 | v134.94,27.62 146.37,39.05 146.37,42.86 148.59,45.09 TM11.2
A12
  Top 0.152: U$1.A11 39.37,16.51 44.77,16.51 45.72,15.56 72.39,15.56 84.45,27.62 105.41,27.62 115.25,37.47 143.19,37.47 149.86,44.13 162.24,44.13 163.83,45.72 TM12.2
AGND  (via drill 0.35)
  Top 0.152: 63.5,46.35 63.18,46.35 62.23,45.4 55.56,45.4 v55.24,45.72 | U3.B2A 182.56,62.55 182.56,54.93 | 182.56,54.93 178.12,54.93 U3.V3 | U3.H3 190.5,47.62 190.18,47.62 182.88,54.93 182.56,54.93 | TM10.3 166.37,61.28 165.1,62.55 153.03,62.55 151.76,61.28 151.13,61.28 TM9.3 | 63.5,46.35 64.45,45.4 80.96,45.4 82.23,44.13 86.04,44.13 87.63,45.72 TM3.3 | 63.5,46.35 U2.H3
  Bottom 0.152: U$1.AGND 44.77,9.21 44.77,13.34 45.4,13.97 45.4,25.72 46.99,27.3 46.99,29.84 49.53,32.38 49.53,45.72 | 49.53,45.72 49.53,52.7 50.8,53.98 U2.V3 50.8,54.93 52.39,56.52 52.39,59.37 U2.B2A | 49.53,45.72 v55.24,45.72 | 173.67,53.34 174.62,54.29 177.8,54.29 U3.V3 | 173.67,53.34 166.37,46.04 TM12.3 | 173.67,53.34 173.67,53.66 166.37,60.96 TM10.3 | 150.81,59.37 150.81,60.01 151.13,60.33 TM9.3 | 150.81,59.37 150.81,46.35 151.13,46.04 TM11.3 | TM16.3 134.62,46.04 134.3,46.35 134.3,60.01 134.62,60.33 TM14.3 134.62,61.28 133.35,62.55 | TM15.3 119.38,46.04 119.06,46.35 119.06,60.01 119.38,60.33 TM13.3 119.38,61.28 118.11,62.55 | 87.63,61.28 86.68,60.33 86.68,46.99 87.63,46.04 TM3.3 | 102.55,60.01 102.55,46.35 102.87,46.04 TM4.3 | 102.55,60.01 102.87,60.33 TM2.3 | 87.63,61.28 88.9,62.55 102.55,62.55 | 102.55,60.01 102.55,62.55 | 87.63,61.28 TM1.3 | 102.55,62.55 118.11,62.55 | 118.11,62.55 133.35,62.55 | 150.81,59.37 147.32,59.37 147.32,61.59 146.37,62.55 133.35,62.55
B1  (via drill 0.35)
  Top 0.152: U$1.11 26.67,31.75 41.27,31.75 43.18,33.66 v76.2,33.66
  Bottom 0.152: v76.2,33.66 83.82,41.27 88.58,41.27 88.58,40.32 89.53,39.37 S1.3
B2  (via drill 0.35)
  Top 0.152: U$1.12 26.35,36.51 39.69,36.51 40.01,36.83 v97.79,36.83
  Bottom 0.152: v97.79,36.83 100.33,39.37 100.97,39.37 S2.3
B3  (via drill 0.35)
  Top 0.152: v33.66,32.38 35.56,34.29 82.55,34.29 85.72,31.11 87.63,31.11 89.22,29.53 89.53,29.53 S3.3
  Bottom 0.152: v33.66,32.38 U$1.24
B4  (via drill 0.35)
  Top 0.152: v43.5,29.21 44.45,28.26 83.5,28.26 83.82,27.94 99.38,27.94 100.65,29.21 100.97,29.21 S4.3
  Bottom 0.152: U$1.25 39.37,29.21 v43.5,29.21
B5  (via drill 0.35)
  Top 0.152: v30.8,39.37 31.11,39.05 39.69,39.05 40.01,39.37 82.23,39.37 84.14,41.27 119.38,41.27 120.97,39.69 121.28,39.69 S13.3
  Bottom 0.152: U$1.26 30.8,40.32 v30.8,39.37
B6  (via drill 0.35)
  Top 0.152: v28.57,45.09 U$1.27 | v45.72,37.47 46.35,38.1 131.13,38.1 132.4,39.37 132.72,39.37 S14.3
  Bottom 0.152: v28.57,45.09 31.43,42.23 31.43,39.05 36.2,34.29 45.72,34.29 v45.72,37.47
B7  (via drill 0.35)
  Top 0.152: U$1.28 26.35,49.85 32.07,49.85 32.38,49.53 36.83,49.53 39.37,52.07 52.39,52.07 52.7,52.39 76.83,52.39 80.33,48.9 v87.31,48.9 | v113.35,28.26 113.67,27.94 119.7,27.94 120.97,29.21 121.28,29.21 S15.3
  Bottom 0.152: v87.31,48.9 89.53,46.67 89.53,42.86 96.52,35.88 106.36,35.88 106.36,35.24 v113.35,28.26
B8  (via drill 0.35)
  Top 0.152: U$1.42 34.29,46.99 36.83,46.99 39.37,44.45 64.77,44.45 66.04,43.18 v90.17,43.18 | v112.39,30.16 113.67,31.43 130.49,31.43 132.4,29.53 132.72,29.53 S16.3
  Bottom 0.152: v90.17,43.18 97.16,36.2 106.68,36.2 106.68,35.88 v112.39,30.16
B9  (via drill 0.35)
  Top 0.152: U$1.43 34.29,52.07 37.47,52.07 v40.01,54.61 | v149.54,51.44 v127.95,73.03
  Bottom 0.152: v40.01,54.61 48.58,54.61 48.58,62.55 59.05,73.03 v127.95,73.03 | v149.54,51.44 149.86,51.12 149.86,43.18 153.03,40.01 S9.3
B10  (via drill 0.35)
  Top 0.152: U$1.44 34.29,54.61 37.47,54.61 40.01,57.15 v42.86,57.15 | v128.91,73.03 152.72,49.21 v162.88,49.21
  Bottom 0.152: v42.86,57.15 48.26,62.55 48.26,62.87 59.05,73.66 128.91,73.66 v128.91,73.03 | v162.88,49.21 162.56,48.9 162.56,41.91 164.47,40.01 S10.3
B11  (via drill 0.35)
  Top 0.152: v136.21,73.03 141.29,67.94 141.29,61.28 141.6,61.28 v153.03,49.85
  Bottom 0.152: U$1.45 31.43,57.47 31.43,61.59 43.81,73.98 136.21,73.98 v136.21,73.03 | v153.03,49.85 154.62,48.26 154.62,31.43 153.03,29.84 S11.3
B12  (via drill 0.35)
  Top 0.152: v57.78,73.34 60.01,71.12 114.3,71.12 v121.28,64.14
  Bottom 0.152: U$1.46 34.29,59.69 41.27,59.69 55.24,73.66 57.78,73.66 v57.78,73.34 | v121.28,64.14 162.56,64.14 162.56,50.48 165.1,47.94 165.1,40.96 166.05,40.01 166.05,31.43 164.47,29.84 S12.3
GND  (via drill 0.35)  (1 unrouted)
  Top 0.152: v213.36,58.42 U1.2
  pour Bottom: 0,76.2 0,0 254,0 254,76.2
  pour Top: 0,76.2 254,76.2 254,-2.54 0,-2.54
GND_MOT
  Top 0.508: U$7.GND1 U$7.GND2
  Bottom 0.508: U$7.GND1 240.03,60.96 246.38,67.31 POWER-5V.GND
I2C_SCL
  Top 0.152: 9.21,66.04 9.21,71.12 8.26,72.07 7.62,72.07 I2C-0.3 | U$1.47 34.29,59.69 30.48,59.69 26.99,63.18 11.43,63.18 9.21,65.41 9.21,66.04 | 9.21,66.04 R5.2
I2C_SDA
  Top 0.152: 5.4,66.04 5.4,72.39 5.08,72.39 I2C-0.4 | U$1.48 34.29,57.15 32.38,57.15 26.67,62.87 7.94,62.87 5.4,65.41 5.4,66.04 | 5.4,66.04 R6.2
L1  (via drill 0.35)
  Top 0.152: v43.5,5.08 42.23,6.35 38.73,6.35 38.1,6.99 28.26,6.99 25.4,9.84 U$1.2
  Bottom 0.152: v43.5,5.08 IC1.1
L2  (via drill 0.35)
  Top 0.152: v45.72,5.71 41.27,1.27 40.01,1.27 37.78,3.49 35.56,3.49 v32.7,6.35
  Bottom 0.152: IC1.2 96.2,5.08 96.2,6.35 95.89,6.67 45.72,6.67 v45.72,5.71 | v32.7,6.35 28.89,10.16 26.67,10.16 26.67,11.11 25.4,12.38 U$1.3
L3
  Top 0.152: IC1.3 100.33,6.03 100.01,6.03 97.16,8.89 35.56,8.89 29.21,15.24 U$1.4
L4  (via drill 0.35)
  Top 0.152: v41.91,4.45 41.27,3.81 37.47,3.81 v34.92,6.35
  Bottom 0.152: IC1.4 101.6,5.08 101.6,6.35 100.97,6.99 43.18,6.99 43.18,5.71 v41.91,4.45 | v34.92,6.35 29.84,11.43 29.84,11.75 28.89,12.7 26.67,12.7 26.67,16.19 25.4,17.46 U$1.5
L5  (via drill 0.35)
  Top 0.152: v45.4,10.48 41.91,13.97 33.02,13.97 29.21,17.78 27.62,17.78 25.4,20 U$1.6
  Bottom 0.152: IC1.5 104.14,5.08 104.14,6.35 102.23,8.26 45.4,8.26 v45.4,10.48
L6  (via drill 0.35)
  Top 0.152: IC1.6 107.95,6.03 107.63,6.03 104.78,8.89 v98.11,8.89 | v46.04,16.19 43.18,19.05 30.48,19.05 27.3,22.23 26.35,22.23 25.72,22.86 U$1.7
  Bottom 0.152: v98.11,8.89 96.52,10.48 46.04,10.48 v46.04,16.19
L7  (via drill 0.35)
  Top 0.152: v50.48,20.32 49.21,21.59 29.53,21.59 25.72,25.4 U$1.8
  Bottom 0.152: IC1.7 109.22,5.08 109.22,6.35 105.09,10.48 104.14,10.48 104.14,15.24 99.06,20.32 v50.48,20.32
L8
  Top 0.152: IC1.8 113.03,6.03 112.71,6.03 109.22,9.53 41.59,9.53 40.96,10.16 U$1.23
L9  (via drill 0.35)
  Top 0.152: v103.19,29.21 99.38,33.02 93.03,33.02 89.85,36.2 v44.77,36.2
  Bottom 0.152: IC2.1 117.47,5.08 117.47,6.35 112.71,11.11 111.76,11.11 111.76,16.51 113.35,18.1 113.35,19.05 v103.19,29.21 | v44.77,36.2 41.59,39.37 31.75,39.37 31.75,48.58 26.99,53.34 U$1.29
L10  (via drill 0.35)
  Top 0.152: v81.92,41.59 81.6,41.91 64.14,41.91 62.23,43.81 v47.62,43.81 | v38.1,49.85 38.42,50.16 39.69,50.16 40.32,50.8 U$1.37
  Bottom 0.152: IC2.2 142.24,5.08 142.24,3.81 141.6,3.17 117.16,3.17 117.16,6.03 112.39,10.79 104.46,10.79 104.46,16.19 97.16,23.5 97.16,26.04 91.12,32.07 91.12,40.01 89.53,41.59 v81.92,41.59 | U$1.37 v47.62,43.81 | U$1.30 31.75,49.53 38.1,49.53 v38.1,49.85
L11  (via drill 0.35)
  Top 0.152: v115.25,43.18 114.62,43.81 66.04,43.81 64.77,45.09 v44.77,45.09
  Bottom 0.152: IC2.3 144.78,5.08 144.78,6.35 128.91,22.23 128.91,26.04 122.87,32.07 122.87,40.01 119.7,43.18 v115.25,43.18 | v44.77,45.09 41.59,48.26 U$1.38 38.1,50.8 U$1.50 35.56,51.12 34.92,51.75 34.92,52.07 31.75,52.07 U$1.31
L12  (via drill 0.35)
  Top 0.152: v49.21,30.48 47.62,32.07 v46.99,32.07
  Bottom 0.152: IC2.4 147.32,5.08 147.32,3.81 146.37,2.86 106.68,2.86 106.68,6.03 101.92,10.79 47.31,10.79 47.31,28.57 v49.21,30.48 | v46.99,32.07 46.35,32.7 46.35,44.45 41.27,49.53 40.01,49.53 36.2,53.34 U$1.49 35.24,53.34 34.29,54.29 34.29,54.61 31.75,54.61 U$1.32
LED1  (via drill 0.35)
  Top 0.152: v81.6,18.41 78.42,18.41 78.42,19.68 R1.2
  Bottom 0.152: v81.6,18.41 83.19,20 94.61,20 94.61,13.97 95.25,13.34 IC1.18
LED2  (via drill 0.35)
  Top 0.152: v100.97,16.51 102.55,16.51 102.55,19.68 R2.2
  Bottom 0.152: v100.97,16.51 97.79,13.34 IC1.17
LED3  (via drill 0.35)
  Top 0.152: v87.31,18.41 82.23,18.41 82.23,19.68 R3.2
  Bottom 0.152: v87.31,18.41 94.61,11.11 99.69,11.11 99.69,11.43 100.33,12.06 IC1.16
LED4  (via drill 0.35)
  Top 0.152: v100.01,18.41 98.74,18.41 98.74,19.68 R4.2
  Bottom 0.152: v100.01,18.41 102.23,16.19 102.23,13.97 102.87,13.34 IC1.15
LED5  (via drill 0.35)
  Top 0.152: v108.9,18.41 108.9,19.68 R17.2
  Bottom 0.152: v108.9,18.41 106.05,15.56 106.05,13.97 105.41,13.34 IC1.14
LED6
  Top 0.152: IC1.13 107.95,12.06 109.22,10.79 133.03,10.79 133.03,19.68 R18.2
LED7  (via drill 0.35)
  Top 0.152: v112.71,18.41 112.71,19.68 R19.2
  Bottom 0.152: v112.71,18.41 111.12,16.83 111.12,13.97 110.49,13.34 IC1.12
LED8
  Top 0.152: IC1.11 113.03,13.34 114.3,14.61 116.2,14.61 120.97,19.37 128.91,19.37 129.22,19.68 R20.2
LED9
  Top 0.152: IC2.18 140.97,13.34 142.24,14.61 143.19,14.61 143.19,19.68 R9.2
LED10
  Top 0.152: IC2.17 143.51,13.34 144.78,14.61 167.32,14.61 167.32,19.68 R10.2
LED11  (via drill 0.35)
  Top 0.152: v147,18.41 147,19.68 R11.2
  Bottom 0.152: v147,18.41 146.69,18.1 146.69,13.97 146.05,13.34 IC2.16
LED12  (via drill 0.35)
  Top 0.152: v154.62,19.37 163.19,19.37 163.51,19.68 R12.2
  Bottom 0.152: v154.62,19.37 148.59,13.34 IC2.15
M_AIN  (via drill 0.35)
  Top 0.152: 212.41,55.88 212.41,57.15 U1.3 | 212.41,55.88 214.95,55.88 v216.53,54.29 | v42.55,46.35 44.77,48.58 56.52,48.58 59.69,51.75 v60.01,51.75 | v145.73,71.12 146.37,71.75 195.9,71.75 211.77,55.88 212.41,55.88
  Bottom 0.152: v216.53,54.29 218.12,52.7 218.12,50.16 219.71,48.58 U$7.AIN1 | U$1.40 34.29,41.91 42.55,41.91 v42.55,46.35 | v60.01,51.75 79.38,71.12 v145.73,71.12
M_BIN  (via drill 0.35)
  Top 0.152: U$7.BIN2 219.39,55.56 215.9,55.56 214.31,57.15 U1.1 | U$1.41 34.29,44.45 37.47,44.45 40.01,41.91 v54.93,41.91 | v150.81,67.94 v149.86,66.99
  Bottom 0.152: v54.93,41.91 59.69,46.67 59.69,47.94 77.79,66.04 149.86,66.04 v149.86,66.99 | v150.81,67.94 152.72,66.04 182.25,66.04 182.25,64.45 190.5,56.2 219.71,56.2 U$7.BIN2
M_JOYB
  Bottom 0.152: U$1.0 36.51,5.08 36.51,16.83 39.05,19.37 39.05,25.72 40.01,26.67 45.09,26.67 45.09,29.21 48.9,33.02 48.9,61.91 56.2,69.22 57.78,69.22 U2.B1A
M_JOYH  (via drill 0.35)
  Top 0.152: U$1.18 45.09,27.3 v47.94,27.3
  Bottom 0.152: v47.94,27.3 49.85,29.21 49.85,35.24 60.96,46.35 U2.H2
M_JOYV
  Bottom 0.152: U$1.17 45.09,25.4 45.09,26.04 46.67,27.62 46.67,30.16 49.21,32.7 49.21,55.24 50.8,56.83 U2.V2
M_PWMA
  Top 0.152: U$1.21 115.57,15.24 128.27,27.94 134.3,27.94 148.59,42.23 218.12,42.23 219.07,43.18 U$7.PWMA
M_PWMB  (via drill 0.35)
  Top 0.152: v42.86,8.26 44.77,6.35 90.81,6.35 v94.93,2.22
  Bottom 0.152: U$1.22 42.86,10.48 v42.86,8.26 | v94.93,2.22 164.15,2.22 164.15,10.79 200.34,46.99 221.3,46.99 221.3,56.52 219.71,58.1 U$7.PWMB
N$1  (via drill 0.35)
  Top 0.152: v80.33,20.95 80.33,19.68 R1.1
  Bottom 0.152: v80.33,20.95 82.87,23.5 82.87,30.48 87,34.61 S1.A
N$2
  Top 0.152: LED13.A R13.1
N$3
  Top 0.152: LED14.A R14.1
N$4
  Top 0.152: LED15.A R15.1
N$5
  Top 0.152: U$7.BIN1 219.39,53.66 216.22,53.66 215.58,54.29 214.31,54.29 U1.6
N$6
  Top 0.152: U$7.AIN2 219.39,46.04 212.41,46.04 212.41,54.29 U1.4
N$7
  Top 0.152: LED16.A R16.1
N$8  (via drill 0.35)
  Top 0.152: v104.46,20.95 104.46,19.68 R2.1
  Bottom 0.152: v104.46,20.95 102.55,22.86 102.55,30.48 98.42,34.61 S2.A
N$9
  Top 0.152: R3.1 84.14,19.68 84.14,22.86 85.41,22.86 86.68,24.13 87,24.13 S3.A
N$10
  Top 0.152: R4.1 100.65,19.68 100.65,22.86 100.01,22.86 98.74,24.13 98.42,24.13 S4.A
N$15  (via drill 0.35)
  Top 0.152: v145.1,20.95 145.1,19.68 R9.1
  Bottom 0.152: v145.1,20.95 146.37,22.23 146.37,30.48 150.5,34.61 S9.A
N$16
  Top 0.152: R10.1 169.23,19.68 169.23,33.02 163.51,33.02 162.24,34.29 161.93,34.29 S10.A
N$17
  Top 0.152: R11.1 148.91,19.68 148.91,23.5 149.54,24.13 150.5,24.13 S11.A
N$18
  Top 0.152: R12.1 165.42,19.68 165.42,22.86 163.51,22.86 162.24,24.13 161.93,24.13 S12.A
N$19
  Top 0.152: R17.1 110.81,19.68 110.81,32.38 116.52,32.38 118.43,34.29 118.75,34.29 S13.A
N$20  (via drill 0.35)
  Top 0.152: v134.94,20.95 134.94,19.68 R18.1
  Bottom 0.152: v134.94,20.95 134.3,21.59 134.3,30.48 130.18,34.61 S14.A
N$21
  Top 0.152: S15.A 118.75,23.5 115.25,20 114.94,20 114.62,19.68 R19.1
N$22
  Top 0.152: R20.1 131.13,19.68 131.13,23.5 130.81,23.5 130.18,24.13 S16.A
N$45
  Bottom 0.508: MOTORS1.P$1 U$7.BO1
N$46
  Bottom 0.508: MOTORS1.P$2 U$7.BO2
N$52
  Bottom 0.508: MOTORS1.P$3 U$7.AO2
N$54
  Bottom 0.508: MOTORS1.P$4 U$7.AO1
S1  (via drill 0.35)
  Top 0.152: U$1.9 26.67,29.21 42.55,29.21 43.18,29.84 v50.48,29.84 | v150.81,65.72 151.13,66.04 162.24,66.04 167.32,71.12 v169.54,71.12
  Bottom 0.152: v50.48,29.84 61.28,40.64 61.28,43.5 63.5,45.72 63.82,45.72 66.67,48.58 66.67,52.07 80.33,65.72 v150.81,65.72 | v169.54,71.12 204.79,71.12 204.79,71.44 205.74,72.39 J1.3
S2  (via drill 0.35)
  Top 0.152: v23.18,58.1 24.77,59.69 v28.89,59.69
  Bottom 0.152: U$1.10 23.18,32.7 v23.18,58.1 | v28.89,59.69 43.5,74.3 218.12,74.3 218.12,72.71 218.44,72.39 J2.3
S_JOYB  (via drill 0.35)
  Top 0.152: v179.39,56.83 182.25,59.69 182.25,68.58 182.88,68.58 183.51,69.22 184.78,69.22 U3.B1A
  Bottom 0.152: U$1.1 24.13,6.35 24.13,4.76 25.08,3.81 94.3,3.81 95.57,2.54 157.48,2.54 157.48,6.35 178.75,27.62 178.75,53.34 179.39,53.98 v179.39,56.83
S_JOYH  (via drill 0.35)
  Top 0.152: v43.5,14.61 47.62,10.48 v162.56,10.48
  Bottom 0.152: U$1.20 43.5,14.92 v43.5,14.61 | v162.56,10.48 187.64,35.56 187.64,46.67 U3.H2
S_JOYV  (via drill 0.35)
  Top 0.152: U$1.19 47.31,20.32 v47.94,20.95 | v76.52,58.74 v76.52,57.47
  Bottom 0.152: v47.94,20.95 76.52,49.53 v76.52,57.47 | v76.52,58.74 79.06,61.28 79.06,63.82 80.33,65.09 171.77,65.09 171.77,63.5 177.8,57.47 U3.V2
U1
  Top 0.152: U$1.51 35.24,45.72 34.61,45.09 34.29,45.09 33.66,44.45 20.32,44.45 17.78,46.99 R13.2
U2
  Top 0.152: R14.2 33.97,41.91 35.24,43.18 U$1.52
U3
  Top 0.152: R15.2 26.99,36.83 30.16,40.01 31.75,40.01 32.38,39.37 33.97,39.37 35.24,40.64 U$1.53
U4
  Top 0.152: U$1.54 35.24,25.4 33.97,26.67 24.77,26.67 20,31.43 17.78,31.43 17.46,31.75 R16.2
VMOT
  Top 0.508: U$7.VMOT 247.65,58.42 248.92,57.15 248.92,32 247.82,30.9 | 247.82,30.9 246.71,29.8 | U$2.OUT+ 247.82,30.9

### Text on the board
Top: ***The TEENSY is on the BOTTOM side of the board; / / KNOBS and BUTTONS are on the TOP side of the board.